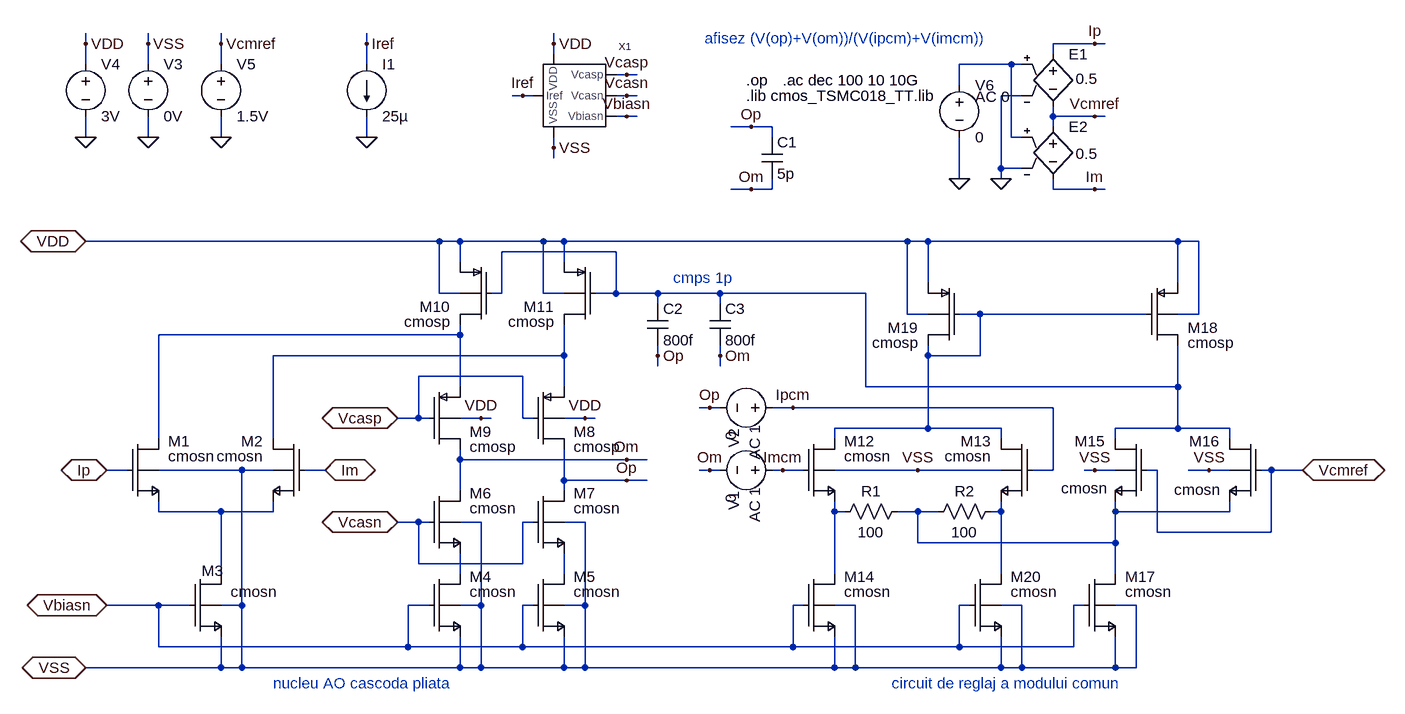
[diagram p0: schematic test_opampFC_cmfb.asc]
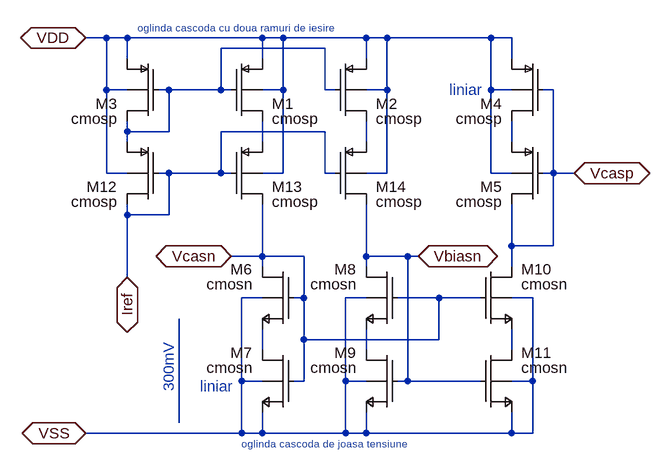
[diagram p1: sub-circuit bias.asc]
test_opampFC_cmfb.asc, the LTspice schematic file:
Version 4
SHEET 1 1072 680
WIRE -1008 -464 -1008 -480
WIRE -912 -464 -912 -480
WIRE -800 -464 -800 -480
WIRE -576 -464 -576 -480
WIRE -288 -464 -288 -480
WIRE 544 -464 480 -464
WIRE 560 -464 544 -464
WIRE -288 -448 -288 -464
WIRE 480 -448 480 -464
WIRE -1008 -432 -1008 -464
WIRE -912 -432 -912 -464
WIRE -800 -432 -800 -464
WIRE -576 -432 -576 -464
WIRE 416 -432 336 -432
WIRE 432 -432 416 -432
WIRE -176 -416 -192 -416
WIRE -160 -416 -176 -416
WIRE 336 -400 336 -432
WIRE -336 -384 -352 -384
WIRE -320 -384 -336 -384
WIRE -176 -384 -192 -384
WIRE -160 -384 -176 -384
WIRE 432 -384 400 -384
WIRE -176 -352 -192 -352
WIRE -160 -352 -176 -352
WIRE 480 -352 480 -368
WIRE 544 -352 480 -352
WIRE 560 -352 544 -352
WIRE 16 -336 -16 -336
WIRE 48 -336 16 -336
WIRE 480 -336 480 -352
WIRE -1008 -320 -1008 -352
WIRE -912 -320 -912 -352
WIRE -800 -320 -800 -352
WIRE -576 -320 -576 -352
WIRE 48 -320 48 -336
WIRE 416 -320 416 -432
WIRE 432 -320 416 -320
WIRE -288 -304 -288 -320
WIRE -288 -288 -288 -304
WIRE 400 -272 400 -384
WIRE 432 -272 400 -272
WIRE 336 -256 336 -320
WIRE 400 -256 400 -272
WIRE 16 -240 -16 -240
WIRE 48 -240 48 -256
WIRE 48 -240 16 -240
WIRE 480 -240 480 -256
WIRE 544 -240 480 -240
WIRE 560 -240 544 -240
WIRE -464 -160 -1008 -160
WIRE -432 -160 -464 -160
WIRE -304 -160 -432 -160
WIRE -272 -160 -304 -160
WIRE 256 -160 -272 -160
WIRE 288 -160 256 -160
WIRE 672 -160 288 -160
WIRE 704 -160 672 -160
WIRE -192 -144 -368 -144
WIRE -432 -128 -432 -160
WIRE -272 -128 -272 -160
WIRE 288 -96 288 -160
WIRE 672 -96 672 -160
WIRE -464 -80 -464 -160
WIRE -432 -80 -464 -80
WIRE -368 -80 -368 -144
WIRE -368 -80 -384 -80
WIRE -304 -80 -304 -160
WIRE -272 -80 -304 -80
WIRE -192 -80 -192 -144
WIRE -192 -80 -224 -80
WIRE -128 -80 -192 -80
WIRE -32 -80 -128 -80
WIRE 192 -80 -32 -80
WIRE -128 -64 -128 -80
WIRE -32 -64 -32 -80
WIRE 256 -48 256 -160
WIRE 288 -48 256 -48
WIRE 368 -48 336 -48
WIRE 624 -48 368 -48
WIRE 704 -48 704 -160
WIRE 704 -48 672 -48
WIRE -432 -16 -432 -32
WIRE -432 -16 -896 -16
WIRE -272 16 -272 -32
WIRE -272 16 -720 16
WIRE -128 16 -128 0
WIRE -32 16 -32 0
WIRE 288 16 288 0
WIRE 368 16 368 -48
WIRE 368 16 288 16
WIRE -128 32 -128 16
WIRE -32 32 -32 16
WIRE -336 48 -496 48
WIRE -432 64 -432 -16
WIRE -272 64 -272 16
WIRE 192 64 192 -80
WIRE 672 64 672 0
WIRE 672 64 192 64
WIRE -48 96 -64 96
WIRE -32 96 -48 96
WIRE 80 96 48 96
WIRE 480 96 80 96
WIRE -496 112 -496 48
WIRE -496 112 -528 112
WIRE -480 112 -496 112
WIRE -400 112 -432 112
WIRE -384 112 -400 112
WIRE -336 112 -336 48
WIRE -320 112 -336 112
WIRE -240 112 -272 112
WIRE -224 112 -240 112
WIRE 288 128 288 16
WIRE 288 128 144 128
WIRE 400 128 288 128
WIRE 672 128 672 64
WIRE 672 128 576 128
WIRE 752 128 672 128
WIRE -896 144 -896 -16
WIRE -720 144 -720 16
WIRE 144 144 144 128
WIRE 400 144 400 128
WIRE 576 144 576 128
WIRE 752 144 752 128
WIRE -432 176 -432 160
WIRE -176 176 -432 176
WIRE -144 176 -176 176
WIRE -944 192 -976 192
WIRE -768 192 -896 192
WIRE -720 192 -768 192
WIRE -640 192 -672 192
WIRE -48 192 -64 192
WIRE -32 192 -48 192
WIRE 64 192 48 192
WIRE 96 192 64 192
WIRE 272 192 144 192
WIRE 400 192 272 192
WIRE 480 192 480 96
WIRE 480 192 448 192
WIRE 544 192 528 192
WIRE 576 192 544 192
WIRE 640 192 624 192
WIRE 720 192 688 192
WIRE 752 192 720 192
WIRE 816 192 800 192
WIRE 864 192 816 192
WIRE -272 208 -272 160
WIRE -176 208 -272 208
WIRE -144 208 -176 208
WIRE -432 224 -432 176
WIRE -272 224 -272 208
WIRE -896 256 -896 240
WIRE -800 256 -896 256
WIRE -720 256 -720 240
WIRE -720 256 -800 256
WIRE 144 256 144 240
WIRE 160 256 144 256
WIRE 272 256 240 256
WIRE 304 256 272 256
WIRE 400 256 400 240
WIRE 400 256 384 256
WIRE 576 256 576 240
WIRE 752 256 752 240
WIRE 752 256 576 256
WIRE -496 272 -528 272
WIRE -480 272 -496 272
WIRE -400 272 -432 272
WIRE -320 272 -336 272
WIRE -240 272 -272 272
WIRE 640 288 640 192
WIRE 816 288 816 192
WIRE 816 288 640 288
WIRE 272 304 272 256
WIRE 576 304 576 256
WIRE 576 304 272 304
WIRE -496 336 -496 272
WIRE -336 336 -336 272
WIRE -336 336 -496 336
WIRE -800 352 -800 256
WIRE -432 352 -432 320
WIRE -272 352 -272 320
WIRE 144 352 144 256
WIRE 400 352 400 256
WIRE 576 352 576 304
WIRE -896 400 -976 400
WIRE -848 400 -896 400
WIRE -768 400 -768 192
WIRE -768 400 -800 400
WIRE -480 400 -512 400
WIRE -400 400 -400 272
WIRE -400 400 -432 400
WIRE -320 400 -336 400
WIRE -240 400 -240 272
WIRE -240 400 -272 400
WIRE 96 400 80 400
WIRE 176 400 144 400
WIRE 352 400 336 400
WIRE 432 400 400 400
WIRE 528 400 512 400
WIRE 608 400 576 400
WIRE -896 464 -896 400
WIRE -512 464 -512 400
WIRE -512 464 -896 464
WIRE -336 464 -336 400
WIRE -336 464 -512 464
WIRE 80 464 80 400
WIRE 80 464 -336 464
WIRE 336 464 336 400
WIRE 336 464 80 464
WIRE 512 464 512 400
WIRE 512 464 336 464
WIRE -800 496 -800 448
WIRE -800 496 -1008 496
WIRE -768 496 -768 400
WIRE -768 496 -800 496
WIRE -432 496 -432 448
WIRE -432 496 -768 496
WIRE -400 496 -400 400
WIRE -400 496 -432 496
WIRE -272 496 -272 448
WIRE -272 496 -400 496
WIRE -240 496 -240 400
WIRE -240 496 -272 496
WIRE 144 496 144 448
WIRE 144 496 -240 496
WIRE 176 496 176 400
WIRE 176 496 144 496
WIRE 400 496 400 448
WIRE 400 496 176 496
WIRE 432 496 432 400
WIRE 432 496 400 496
WIRE 576 496 576 448
WIRE 576 496 432 496
WIRE 608 496 608 400
WIRE 608 496 576 496
FLAG -1008 -160 VDD
IOPIN -1008 -160 BiDir
FLAG -1008 496 VSS
IOPIN -1008 496 BiDir
FLAG -976 400 Vbiasn
IOPIN -976 400 BiDir
FLAG -528 272 Vcasn
IOPIN -528 272 BiDir
FLAG -528 112 Vcasp
IOPIN -528 112 BiDir
FLAG -640 192 Im
IOPIN -640 192 BiDir
FLAG -976 192 Ip
IOPIN -976 192 BiDir
FLAG -400 112 VDD
FLAG -240 112 VDD
FLAG 272 192 VSS
FLAG 864 192 Vcmref
IOPIN 864 192 BiDir
FLAG 544 192 VSS
FLAG 720 192 VSS
FLAG -912 -320 0
FLAG -1008 -320 0
FLAG -1008 -464 VDD
FLAG -912 -464 VSS
FLAG -576 -320 0
FLAG -576 -464 Iref
FLAG -800 -320 0
FLAG -800 -464 Vcmref
FLAG -288 -464 VDD
FLAG -336 -384 Iref
FLAG -288 -304 VSS
FLAG -176 -416 Vcasp
FLAG -176 -384 Vcasn
FLAG -176 -352 Vbiasn
FLAG 400 -256 0
FLAG 336 -256 0
FLAG 544 -464 Ip
FLAG 544 -352 Vcmref
FLAG 544 -240 Im
FLAG 16 -336 Op
FLAG 16 -240 Om
FLAG -176 208 Op
FLAG -176 176 Om
FLAG -128 16 Op
FLAG -32 16 Om
FLAG 64 192 Imcm
FLAG 80 96 Ipcm
FLAG -48 96 Op
FLAG -48 192 Om
SYMBOL nmosb -944 144 R0
WINDOW 0 63 4 Left 2
SYMATTR InstName M1
SYMATTR Value cmosn
SYMATTR Value2 l=1u w=5.1u ad=1.02p as=1.02p pd=10.6u ps=10.6u m=5
SYMBOL nmosb -672 144 M0
WINDOW 0 63 4 Left 2
SYMATTR InstName M2
SYMATTR Value cmosn
SYMATTR Value2 l=1u w=5.1u ad=1.02p as=1.02p pd=10.6u ps=10.6u m=5
SYMBOL nmosb -848 352 R0
WINDOW 0 18 -5 Left 2
SYMATTR InstName M3
SYMATTR Value cmosn
SYMATTR Value2 l=1u w=2.7u ad=0.54p as=0.54p pd=5.8u ps=5.8u m=12
SYMBOL nmosb -480 352 R0
WINDOW 0 63 4 Left 2
SYMATTR InstName M4
SYMATTR Value cmosn
SYMATTR Value2 l=1u w=2.7u ad=0.54p as=0.54p pd=5.8u ps=5.8u m=9
SYMBOL nmosb -320 352 R0
WINDOW 0 63 4 Left 2
SYMATTR InstName M5
SYMATTR Value cmosn
SYMATTR Value2 l=1u w=2.7u ad=0.54p as=0.54p pd=5.8u ps=5.8u m=9
SYMBOL nmosb -480 224 R0
WINDOW 0 63 4 Left 2
SYMATTR InstName M6
SYMATTR Value cmosn
SYMATTR Value2 l=1u w=2.7u ad=0.54p as=0.54p pd=5.8u ps=5.8u m=9
SYMBOL nmosb -320 224 R0
WINDOW 0 63 4 Left 2
SYMATTR InstName M7
SYMATTR Value cmosn
SYMATTR Value2 l=1u w=2.7u ad=0.54p as=0.54p pd=5.8u ps=5.8u m=9
SYMBOL pmosb -320 64 R0
WINDOW 0 63 69 Left 2
SYMATTR InstName M8
SYMATTR Value cmosp
SYMATTR Value2 l=1u w=14u ad=2.8p as=2.8p pd=28.4u ps=28.4u m=9
SYMBOL pmosb -480 64 R0
WINDOW 0 63 69 Left 2
SYMATTR InstName M9
SYMATTR Value cmosp
SYMATTR Value2 l=1u w=14u ad=2.8p as=2.8p pd=28.4u ps=28.4u m=9
SYMBOL pmosb -384 -128 M0
WINDOW 0 63 69 Left 2
SYMATTR InstName M10
SYMATTR Value cmosp
SYMATTR Value2 l=1u w=14u ad=2.8p as=2.8p pd=28.4u ps=28.4u m=15
SYMBOL pmosb -224 -128 M0
WINDOW 0 63 69 Left 2
SYMATTR InstName M11
SYMATTR Value cmosp
SYMATTR Value2 l=1u w=14u ad=2.8p as=2.8p pd=28.4u ps=28.4u m=15
SYMBOL voltage 64 192 R90
WINDOW 0 47 59 Top 2
WINDOW 3 44 95 Bottom 2
WINDOW 123 54 58 Bottom 2
WINDOW 39 0 0 Left 2
SYMATTR InstName V1
SYMATTR Value 0
SYMATTR Value2 AC 1
SYMBOL nmosb 96 144 R0
SYMATTR InstName M12
SYMATTR Value cmosn
SYMATTR Value2 l=1u w=2.7u ad=0.54p as=0.54p pd=5.8u ps=5.8u m=1
SYMBOL nmosb 448 144 M0
SYMATTR InstName M13
SYMATTR Value cmosn
SYMATTR Value2 l=1u w=2.7u ad=0.54p as=0.54p pd=5.8u ps=5.8u m=1
SYMBOL nmosb 96 352 R0
SYMATTR InstName M14
SYMATTR Value cmosn
SYMATTR Value2 l=1u w=2.7u ad=0.54p as=0.54p pd=5.8u ps=5.8u m=1
SYMBOL res 256 240 R90
WINDOW 0 0 56 VBottom 2
WINDOW 3 32 56 VTop 2
SYMATTR InstName R1
SYMATTR Value 100
SYMBOL res 400 240 R90
WINDOW 0 0 56 VBottom 2
WINDOW 3 32 56 VTop 2
SYMATTR InstName R2
SYMATTR Value 100
SYMBOL nmosb 624 144 M0
WINDOW 3 60 76 Left 2
SYMATTR Value cmosn
SYMATTR InstName M15
SYMATTR Value2 l=1u w=2.7u ad=0.54p as=0.54p pd=5.8u ps=5.8u m=1
SYMBOL nmosb 800 144 M0
WINDOW 3 62 78 Left 2
SYMATTR Value cmosn
SYMATTR InstName M16
SYMATTR Value2 l=1u w=2.7u ad=0.54p as=0.54p pd=5.8u ps=5.8u m=1
SYMBOL nmosb 528 352 R0
SYMATTR InstName M17
SYMATTR Value cmosn
SYMATTR Value2 l=1u w=2.7u ad=0.54p as=0.54p pd=5.8u ps=5.8u m=2
SYMBOL pmosb 624 -96 R0
SYMATTR InstName M18
SYMATTR Value cmosp
SYMATTR Value2 l=1u w=14u ad=2.8p as=2.8p pd=28.4u ps=28.4u m=2
SYMBOL pmosb 336 -96 M0
SYMATTR InstName M19
SYMATTR Value cmosp
SYMATTR Value2 l=1u w=14u ad=2.8p as=2.8p pd=28.4u ps=28.4u m=2
SYMBOL voltage -912 -448 R0
SYMATTR InstName V3
SYMATTR Value 0V
SYMBOL voltage -1008 -448 R0
SYMATTR InstName V4
SYMATTR Value 3V
SYMBOL current -576 -432 R0
SYMATTR InstName I1
SYMATTR Value 25µ
SYMBOL voltage -800 -448 R0
SYMATTR InstName V5
SYMATTR Value 1.5V
SYMBOL bias -304 -432 R0
SYMATTR InstName X1
SYMBOL e 480 -464 R0
WINDOW 3 35 54 Left 2
SYMATTR Value 0.5
SYMATTR InstName E1
SYMBOL e 480 -352 R0
WINDOW 3 35 57 Left 2
SYMATTR Value 0.5
SYMATTR InstName E2
SYMBOL voltage 336 -416 R0
WINDOW 123 24 34 Left 2
WINDOW 39 0 0 Left 2
SYMATTR Value2 AC 0
SYMATTR InstName V6
SYMATTR Value 0
SYMBOL cap 32 -320 R0
SYMATTR InstName C1
SYMATTR Value 5p
SYMBOL nmosb 352 352 R0
SYMATTR InstName M20
SYMATTR Value cmosn
SYMATTR Value2 l=1u w=2.7u ad=0.54p as=0.54p pd=5.8u ps=5.8u m=1
SYMBOL cap -144 -64 R0
SYMATTR InstName C2
SYMATTR Value 800f
SYMBOL cap -48 -64 R0
SYMATTR InstName C3
SYMATTR Value 800f
SYMBOL voltage 64 96 R90
WINDOW 0 47 59 Top 2
WINDOW 3 44 95 Bottom 2
WINDOW 123 54 58 Bottom 2
WINDOW 39 0 0 Left 2
SYMATTR InstName V2
SYMATTR Value 0
SYMATTR Value2 AC 1
TEXT 8 -384 Left 2 !.lib cmos_TSMC018_TT.lib
TEXT 8 -408 Left 2 !.op
TEXT 64 -408 Left 2 !.ac dec 100 10 10G
TEXT -56 -472 Left 2 ;afisez (V(op)+V(om))/(V(ipcm)+V(imcm))
TEXT -104 -104 Left 2 ;cmps 1p
TEXT -720 520 Left 2 ;nucleu AO cascoda pliata
TEXT 232 520 Left 2 ;circuit de reglaj a modului comun

bias.asc, the sub-circuit schematic file:
Version 4
SHEET 1 880 716
WIRE -144 48 -176 48
WIRE -112 48 -144 48
WIRE 96 48 -112 48
WIRE 128 48 96 48
WIRE 256 48 128 48
WIRE 288 48 256 48
WIRE 448 48 288 48
WIRE 480 48 448 48
WIRE 192 64 32 64
WIRE -112 80 -112 48
WIRE 96 80 96 48
WIRE 256 80 256 48
WIRE 480 80 480 48
WIRE -144 128 -144 48
WIRE -112 128 -144 128
WIRE -48 128 -64 128
WIRE 32 128 32 64
WIRE 32 128 -48 128
WIRE 48 128 32 128
WIRE 128 128 128 48
WIRE 128 128 96 128
WIRE 192 128 192 64
WIRE 208 128 192 128
WIRE 288 128 288 48
WIRE 288 128 256 128
WIRE 448 128 448 48
WIRE 480 128 448 128
WIRE 544 128 528 128
WIRE -112 192 -112 176
WIRE -48 192 -48 128
WIRE -48 192 -112 192
WIRE 192 192 32 192
WIRE -112 208 -112 192
WIRE 96 208 96 176
WIRE 256 208 256 176
WIRE 480 208 480 176
WIRE -144 256 -144 128
WIRE -112 256 -144 256
WIRE -48 256 -64 256
WIRE 32 256 32 192
WIRE 32 256 -48 256
WIRE 48 256 32 256
WIRE 128 256 128 128
WIRE 128 256 96 256
WIRE 192 256 192 192
WIRE 208 256 192 256
WIRE 288 256 288 128
WIRE 288 256 256 256
WIRE 448 256 448 128
WIRE 480 256 448 256
WIRE 544 256 544 128
WIRE 544 256 528 256
WIRE 576 256 544 256
WIRE -112 320 -112 304
WIRE -48 320 -48 256
WIRE -48 320 -112 320
WIRE 480 368 480 304
WIRE 544 368 544 256
WIRE 544 368 480 368
WIRE 96 384 96 304
WIRE 96 384 48 384
WIRE 160 384 96 384
WIRE 256 384 256 304
WIRE 320 384 256 384
WIRE 336 384 320 384
WIRE 96 400 96 384
WIRE 256 400 256 384
WIRE 480 400 480 368
WIRE -112 416 -112 320
WIRE 96 448 64 448
WIRE 160 448 160 384
WIRE 160 448 144 448
WIRE 256 448 224 448
WIRE 368 448 304 448
WIRE 432 448 368 448
WIRE 512 448 480 448
WIRE 160 512 160 448
WIRE 368 512 368 448
WIRE 368 512 160 512
WIRE 96 528 96 496
WIRE 256 528 256 496
WIRE 480 528 480 496
WIRE 64 576 64 448
WIRE 96 576 64 576
WIRE 160 576 160 512
WIRE 160 576 144 576
WIRE 224 576 224 448
WIRE 256 576 224 576
WIRE 320 576 320 384
WIRE 320 576 304 576
WIRE 432 576 320 576
WIRE 512 576 512 448
WIRE 512 576 480 576
WIRE -32 640 -32 480
WIRE 64 656 64 576
WIRE 64 656 -176 656
WIRE 96 656 96 624
WIRE 96 656 64 656
WIRE 224 656 224 576
WIRE 224 656 96 656
WIRE 256 656 256 624
WIRE 256 656 224 656
WIRE 480 656 480 624
WIRE 480 656 256 656
WIRE 512 656 512 576
WIRE 512 656 480 656
FLAG 336 384 Vbiasn
IOPIN 336 384 BiDir
FLAG 576 256 Vcasp
IOPIN 576 256 BiDir
FLAG 48 384 Vcasn
IOPIN 48 384 BiDir
FLAG -112 416 Iref
IOPIN -112 416 BiDir
FLAG -176 48 VDD
IOPIN -176 48 BiDir
FLAG -176 656 VSS
IOPIN -176 656 BiDir
SYMBOL pmosb 48 80 R0
SYMATTR InstName M1
SYMATTR Value cmosp
SYMATTR Value2 l=1u w=14u ad=2.8p as=2.8p pd=28.4u ps=28.4u m=1
SYMBOL pmosb 208 80 R0
SYMATTR InstName M2
SYMATTR Value cmosp
SYMATTR Value2 l=1u w=14u ad=2.8p as=2.8p pd=28.4u ps=28.4u m=1
SYMBOL pmosb -64 80 M0
SYMATTR InstName M3
SYMATTR Value cmosp
SYMATTR Value2 l=1u w=14u ad=2.8p as=2.8p pd=28.4u ps=28.4u m=1
SYMBOL pmosb 528 80 M0
SYMATTR InstName M4
SYMATTR Value cmosp
SYMATTR Value2 l=2u w=6.3u ad=1.26p as=1.26p pd=13u ps=13u m=1
SYMBOL pmosb 528 208 M0
SYMATTR InstName M5
SYMATTR Value cmosp
SYMATTR Value2 l=1u w=14u ad=2.8p as=2.8p pd=28.4u ps=28.4u m=1
SYMBOL nmosb 144 400 M0
SYMATTR InstName M6
SYMATTR Value cmosn
SYMATTR Value2 l=1u w=2.7u ad=0.54p as=0.54p pd=5.8u ps=5.8u m=1
SYMBOL nmosb 144 528 M0
SYMATTR InstName M7
SYMATTR Value cmosn
SYMATTR Value2 l=2u w=1.3u ad=0.26p as=0.26p pd=3u ps=3u m=1
SYMBOL nmosb 304 400 M0
SYMATTR InstName M8
SYMATTR Value cmosn
SYMATTR Value2 l=1u w=2.7u ad=0.54p as=0.54p pd=5.8u ps=5.8u m=1
SYMBOL nmosb 304 528 M0
SYMATTR InstName M9
SYMATTR Value cmosn
SYMATTR Value2 l=1u w=2.7u ad=0.54p as=0.54p pd=5.8u ps=5.8u m=1
SYMBOL nmosb 432 400 R0
SYMATTR InstName M10
SYMATTR Value cmosn
SYMATTR Value2 l=1u w=2.7u ad=0.54p as=0.54p pd=5.8u ps=5.8u m=1
SYMBOL nmosb 432 528 R0
SYMATTR InstName M11
SYMATTR Value cmosn
SYMATTR Value2 l=1u w=2.7u ad=0.54p as=0.54p pd=5.8u ps=5.8u m=1
SYMBOL pmosb -64 208 M0
SYMATTR InstName M12
SYMATTR Value cmosp
SYMATTR Value2 l=1u w=14u ad=2.8p as=2.8p pd=28.4u ps=28.4u m=1
SYMBOL pmosb 48 208 R0
SYMATTR InstName M13
SYMATTR Value cmosp
SYMATTR Value2 l=1u w=14u ad=2.8p as=2.8p pd=28.4u ps=28.4u m=1
SYMBOL pmosb 208 208 R0
SYMATTR InstName M14
SYMATTR Value cmosp
SYMATTR Value2 l=1u w=14u ad=2.8p as=2.8p pd=28.4u ps=28.4u m=1
TEXT 0 584 Left 2 ;liniar
TEXT 384 128 Left 2 ;liniar
TEXT -48 592 VLeft 2 ;300mV
TEXT 64 672 Left 1 ;oglinda cascoda de joasa tensiune
TEXT -96 32 Left 1 ;oglinda cascoda cu doua ramuri de iesire

The netlist it stands for:
* test_opampFC_cmfb.asc
M1 N004 Ip N006 VSS cmosn l=1u w=5.1u ad=1.02p as=1.02p pd=10.6u ps=10.6u m=5
M2 N005 Im N006 VSS cmosn l=1u w=5.1u ad=1.02p as=1.02p pd=10.6u ps=10.6u m=5
M3 N006 Vbiasn VSS VSS cmosn l=1u w=2.7u ad=0.54p as=0.54p pd=5.8u ps=5.8u m=12
M4 N010 Vbiasn VSS VSS cmosn l=1u w=2.7u ad=0.54p as=0.54p pd=5.8u ps=5.8u m=9
M5 N011 Vbiasn VSS VSS cmosn l=1u w=2.7u ad=0.54p as=0.54p pd=5.8u ps=5.8u m=9
M6 Om Vcasn N010 VSS cmosn l=1u w=2.7u ad=0.54p as=0.54p pd=5.8u ps=5.8u m=9
M7 Op Vcasn N011 VSS cmosn l=1u w=2.7u ad=0.54p as=0.54p pd=5.8u ps=5.8u m=9
M8 Op Vcasp N005 VDD cmosp l=1u w=14u ad=2.8p as=2.8p pd=28.4u ps=28.4u m=9
M9 Om Vcasp N004 VDD cmosp l=1u w=14u ad=2.8p as=2.8p pd=28.4u ps=28.4u m=9
M10 N004 N002 VDD VDD cmosp l=1u w=14u ad=2.8p as=2.8p pd=28.4u ps=28.4u m=15
M11 N005 N002 VDD VDD cmosp l=1u w=14u ad=2.8p as=2.8p pd=28.4u ps=28.4u m=15
V1 Imcm Om 0 AC 1
M12 N003 Imcm N007 VSS cmosn l=1u w=2.7u ad=0.54p as=0.54p pd=5.8u ps=5.8u m=1
M13 N003 Ipcm N009 VSS cmosn l=1u w=2.7u ad=0.54p as=0.54p pd=5.8u ps=5.8u m=1
M14 N007 Vbiasn VSS VSS cmosn l=1u w=2.7u ad=0.54p as=0.54p pd=5.8u ps=5.8u m=1
R1 N008 N007 100
R2 N009 N008 100
M15 N002 Vcmref N008 VSS cmosn l=1u w=2.7u ad=0.54p as=0.54p pd=5.8u ps=5.8u m=1
M16 N002 Vcmref N008 VSS cmosn l=1u w=2.7u ad=0.54p as=0.54p pd=5.8u ps=5.8u m=1
M17 N008 Vbiasn VSS VSS cmosn l=1u w=2.7u ad=0.54p as=0.54p pd=5.8u ps=5.8u m=2
M18 N002 N003 VDD VDD cmosp l=1u w=14u ad=2.8p as=2.8p pd=28.4u ps=28.4u m=2
M19 N003 N003 VDD VDD cmosp l=1u w=14u ad=2.8p as=2.8p pd=28.4u ps=28.4u m=2
V3 VSS 0 0V
V4 VDD 0 3V
I1 Iref 0 25µ
V5 Vcmref 0 1.5V
XX1 VDD Iref VSS Vbiasn Vcasn Vcasp bias
E1 Ip Vcmref N001 0 0.5
E2 Vcmref Im N001 0 0.5
V6 N001 0 0 AC 0
C1 Op Om 5p
M20 N009 Vbiasn VSS VSS cmosn l=1u w=2.7u ad=0.54p as=0.54p pd=5.8u ps=5.8u m=1
C2 N002 Op 800f
C3 N002 Om 800f
V2 Ipcm Op 0 AC 1

* block symbol definitions
.subckt bias VDD Iref VSS Vbiasn Vcasn Vcasp
M1 N002 N001 VDD VDD cmosp l=1u w=14u ad=2.8p as=2.8p pd=28.4u ps=28.4u m=1
M2 N003 N001 VDD VDD cmosp l=1u w=14u ad=2.8p as=2.8p pd=28.4u ps=28.4u m=1
M3 N001 N001 VDD VDD cmosp l=1u w=14u ad=2.8p as=2.8p pd=28.4u ps=28.4u m=1
M4 N004 Vcasp VDD VDD cmosp l=2u w=6.3u ad=1.26p as=1.26p pd=13u ps=13u m=1
M5 Vcasp Vcasp N004 VDD cmosp l=1u w=14u ad=2.8p as=2.8p pd=28.4u ps=28.4u m=1
M6 Vcasn Vcasn N005 VSS cmosn l=1u w=2.7u ad=0.54p as=0.54p pd=5.8u ps=5.8u m=1
M7 N005 Vcasn VSS VSS cmosn l=2u w=1.3u ad=0.26p as=0.26p pd=3u ps=3u m=1
M8 Vbiasn Vcasn N006 VSS cmosn l=1u w=2.7u ad=0.54p as=0.54p pd=5.8u ps=5.8u m=1
M9 N006 Vbiasn VSS VSS cmosn l=1u w=2.7u ad=0.54p as=0.54p pd=5.8u ps=5.8u m=1
M10 Vcasp Vcasn N007 VSS cmosn l=1u w=2.7u ad=0.54p as=0.54p pd=5.8u ps=5.8u m=1
M11 N007 Vbiasn VSS VSS cmosn l=1u w=2.7u ad=0.54p as=0.54p pd=5.8u ps=5.8u m=1
M12 Iref Iref N001 VDD cmosp l=1u w=14u ad=2.8p as=2.8p pd=28.4u ps=28.4u m=1
M13 Vcasn Iref N002 VDD cmosp l=1u w=14u ad=2.8p as=2.8p pd=28.4u ps=28.4u m=1
M14 Vbiasn Iref N003 VDD cmosp l=1u w=14u ad=2.8p as=2.8p pd=28.4u ps=28.4u m=1
* liniar
* liniar
* 300mV
* oglinda cascoda de joasa tensiune
* oglinda cascoda cu doua ramuri de iesire
.ends bias

.model NMOS NMOS
.model PMOS PMOS
.lib standard.mos
.lib cmos_TSMC018_TT.lib
.op
.ac dec 100 10 10G
* afisez (V(op)+V(om))/(V(ipcm)+V(imcm))
* cmps 1p
* nucleu AO cascoda pliata
* circuit de reglaj a modului comun
.backanno
.end